# EAGLE schematic OTOsenseShield (EAGLE 6.1)
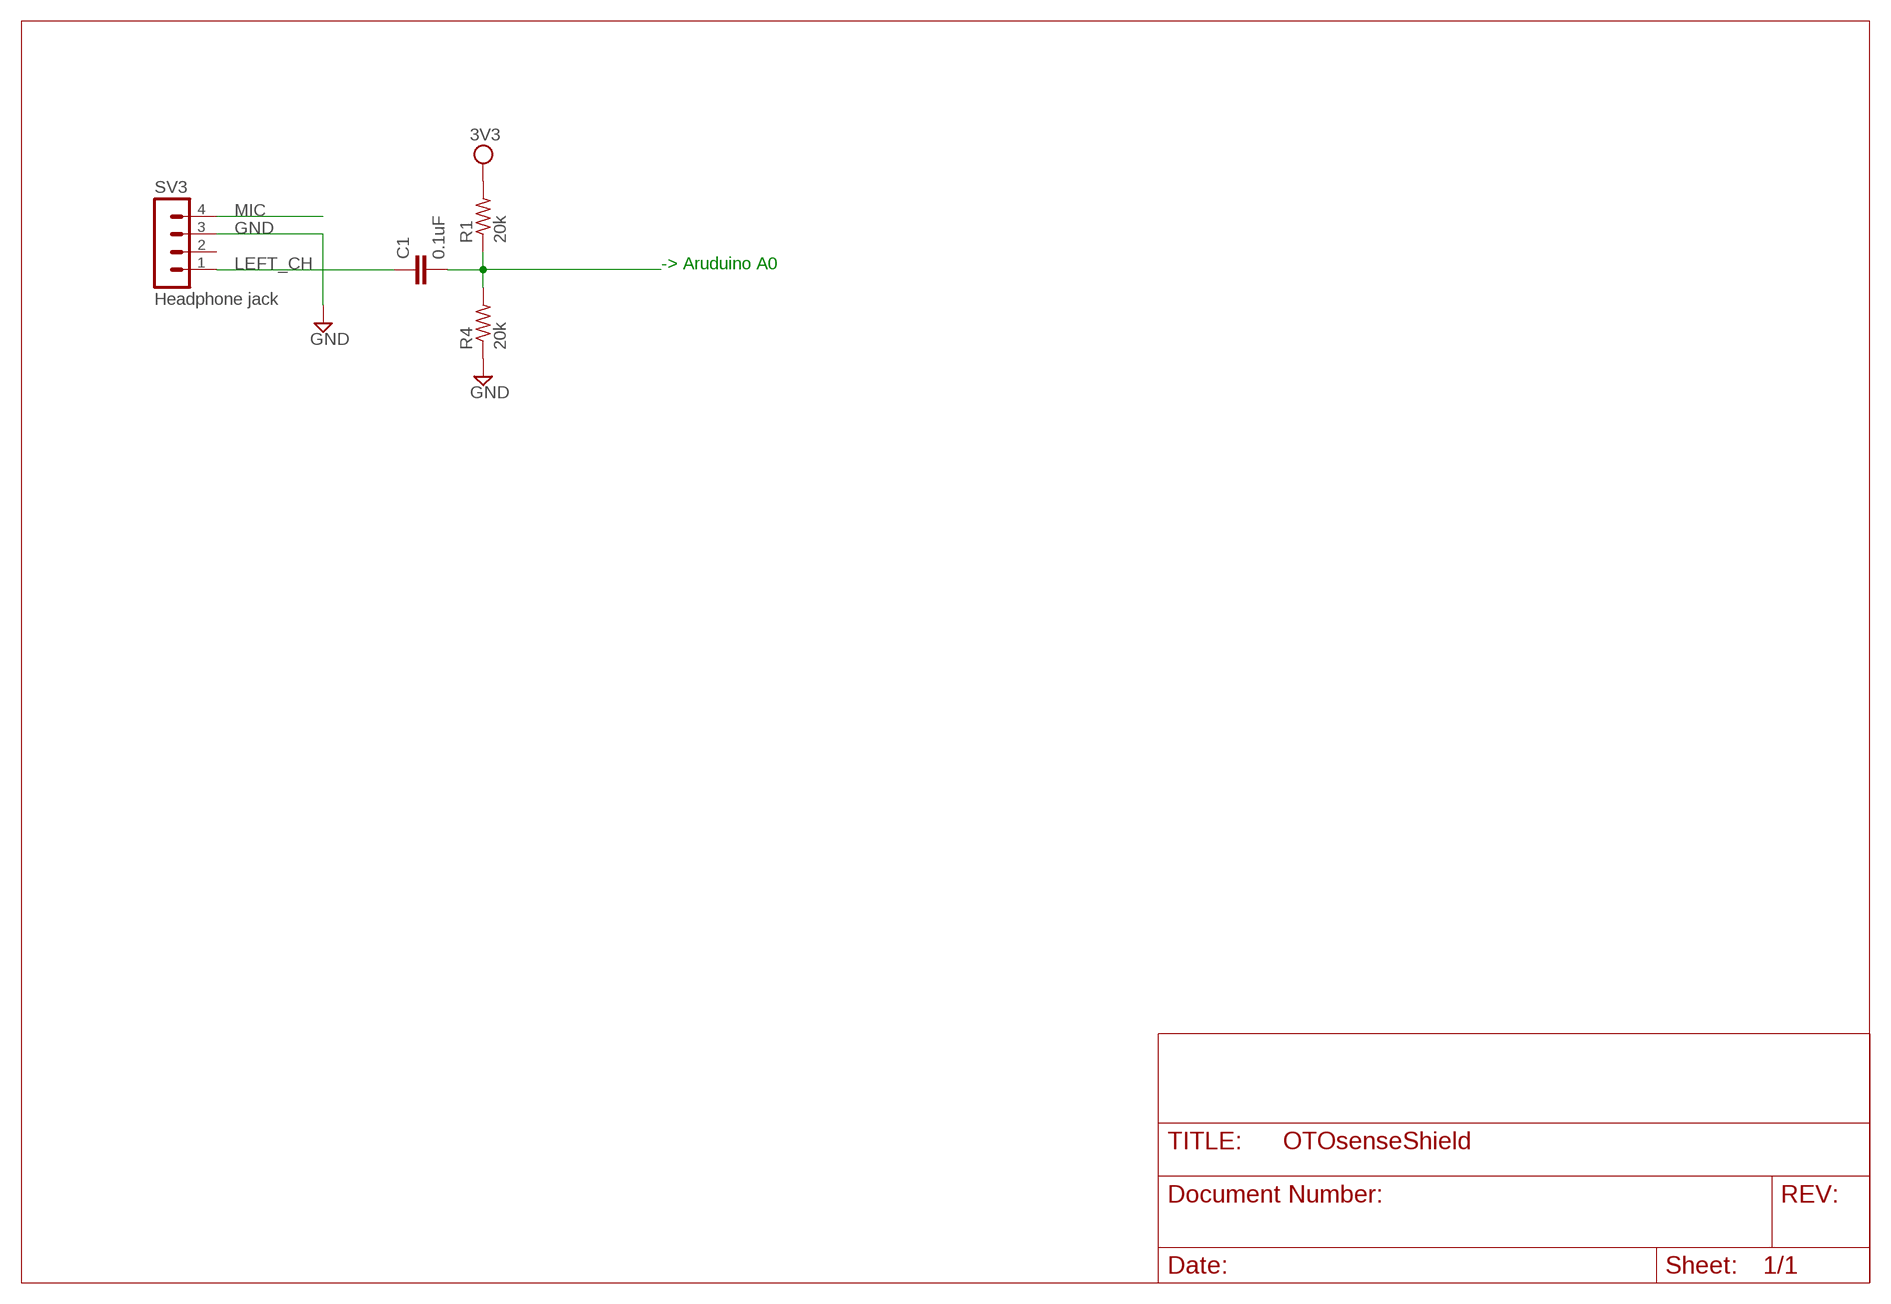
[diagram p0: schematic, sheet 1]

## Parts
C1  0.1uF  C-EU025_050-035X075  [C025_050-035X075]
R1  20k  R-US_0309/10  [0309/10]
R4  20k  R-US_0309/10  [0309/10]
SV3  Headphone jack  MA04-1  [MA04-1]

## Nets
GND: R4.1 SV3.3
LEFT_CH: C1.1 SV3.1
MIC: SV3.4
N$1: C1.2 R1.1 R4.2
VDD: R1.2 ; supply symbol labelled 3V3
Unconnected: SV3.2

## Notes on the sheet
- -> Aruduino A0

## Library data of the parts
C1 = rcl:C-EU: CAPACITOR, European symbol
R1 R4 = resistor:R-US_: RESISTOR, American symbol
SV3 = con-lstb:MA04-1: PIN HEADER; OC_FARNELL: unknown; OC_NEWARK: unknown